# EAGLE board das48 (EAGLE 9.6.2), part 1 of 2
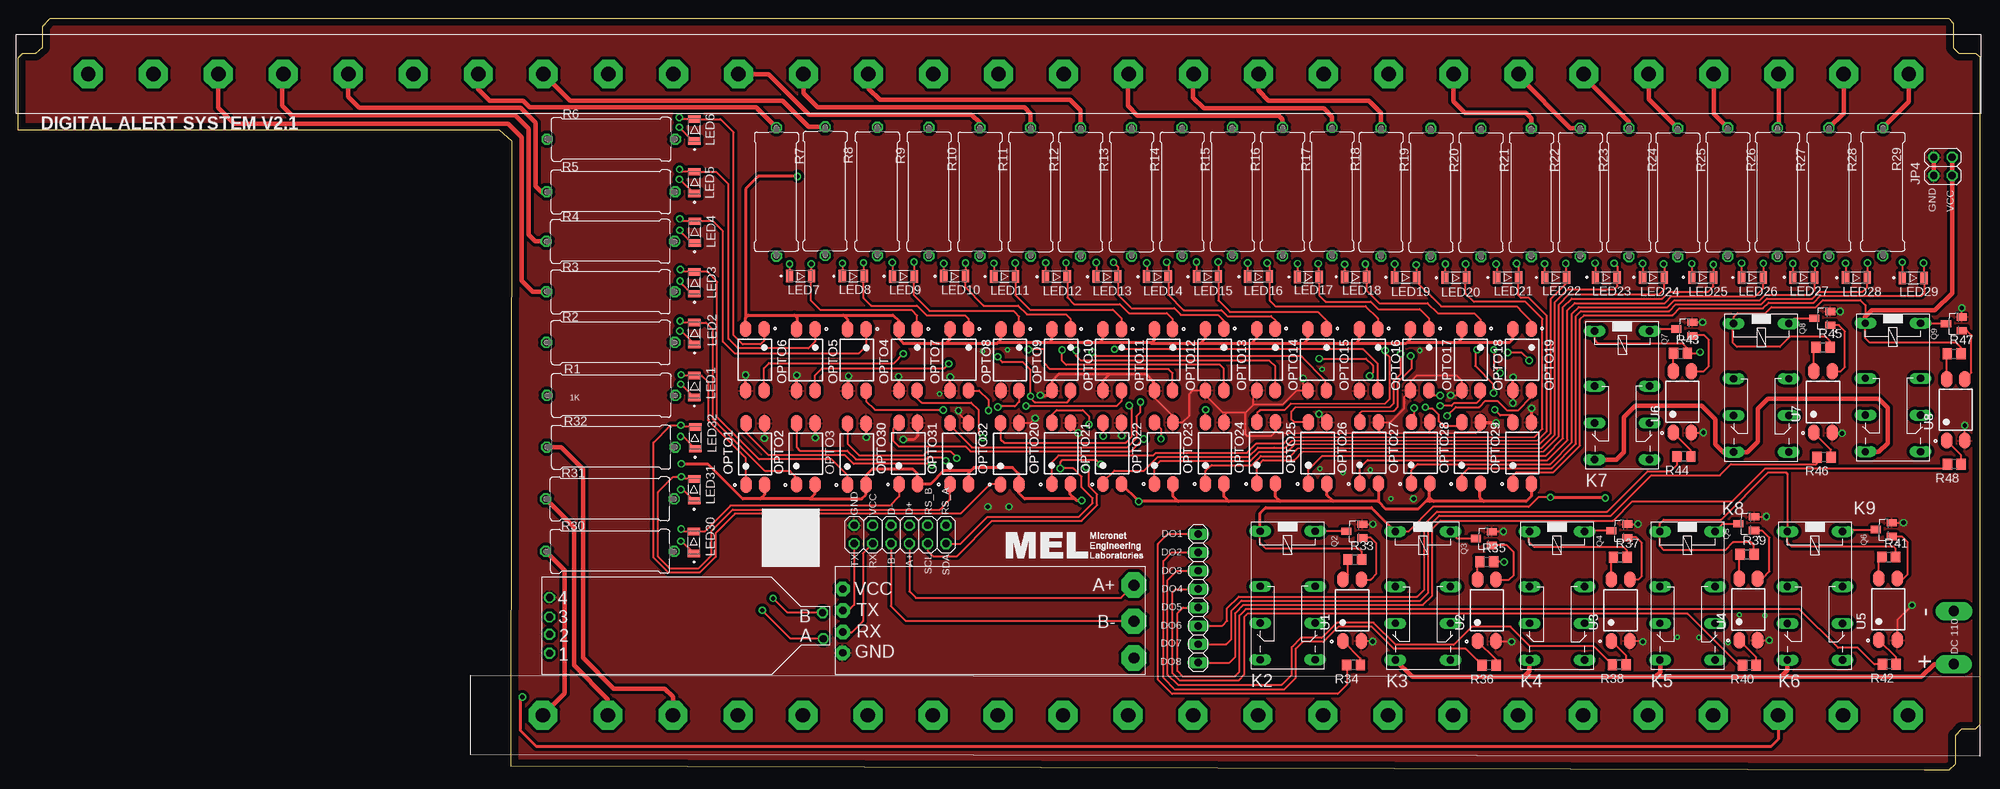
[diagram p2: board, top side]
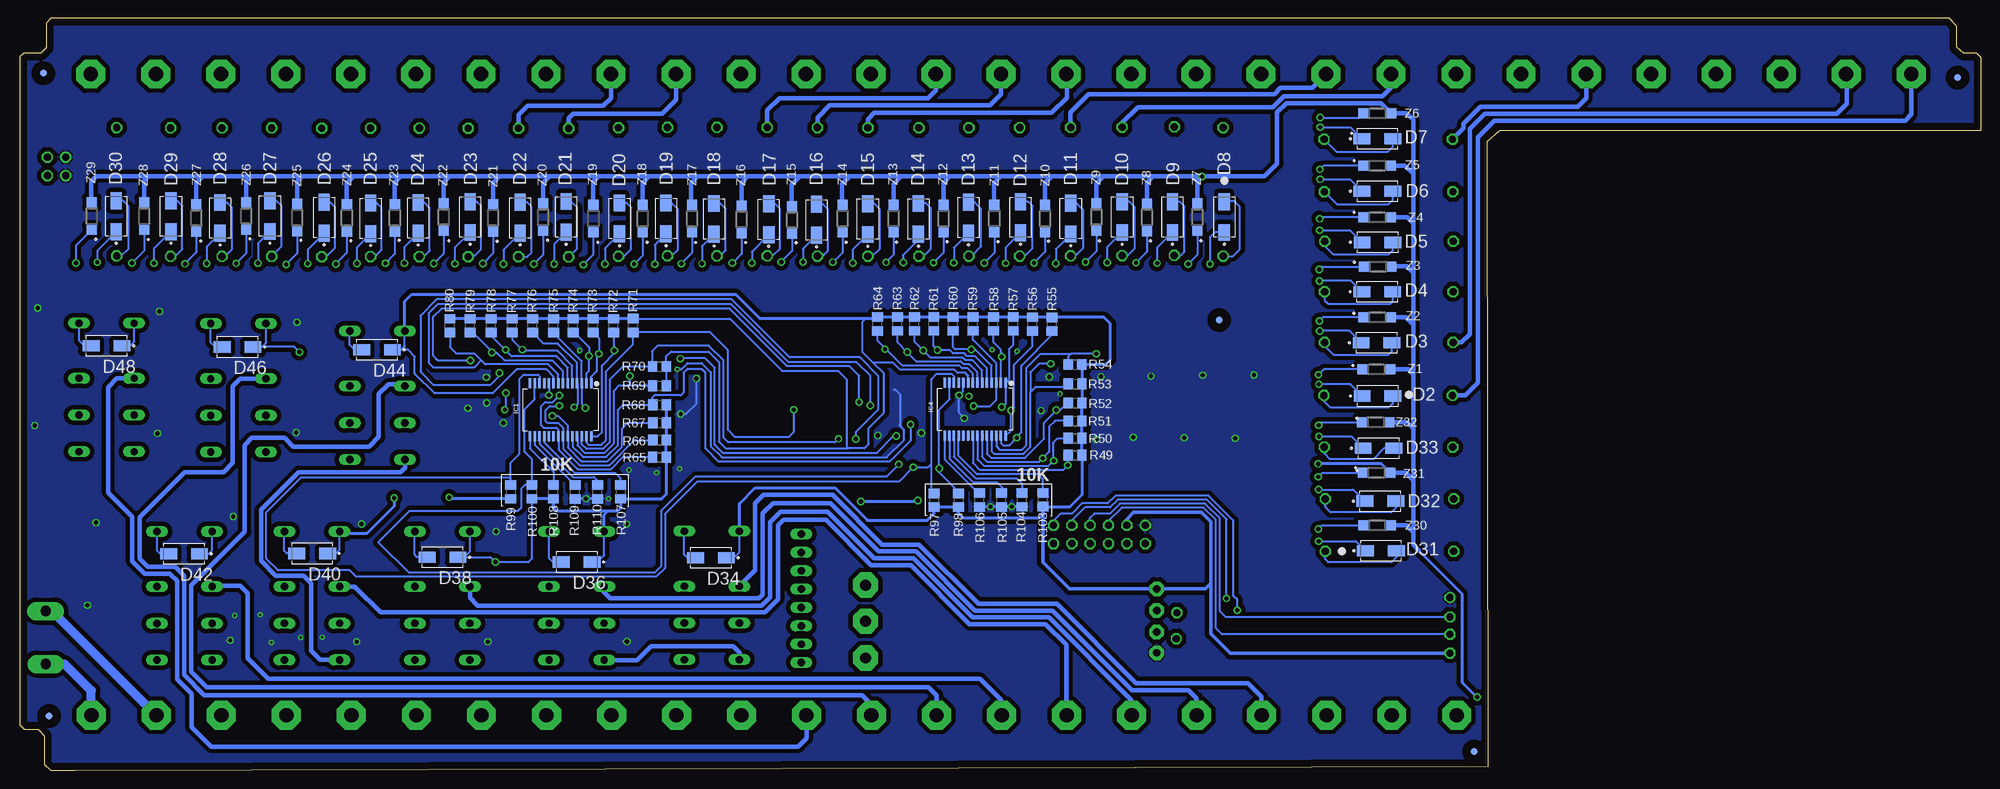
[diagram p3: board, bottom side, seen from below]

Size 271.53 x 104.12 mm. Coordinates in mm from the lower left corner, seen from the top.
Outline: 0.01,88.6 0,97.18 0.01,98.6 0.67,99.26 2.42,99.26 3.4,100.11 3.41,102.98 4.42,104.12 6.94,104.12 264.15,104.12 267.26,104.12 267.87,103.39 267.87,100.03 268.62,99.28 271.02,99.28 271.53,98.77 271.53,96.75 271.53,6.29 270.9,5.67 268.97,5.67 268.14,4.82 268.14,0.86 267.28,0 263.89,0 263.89,0 68.27,0.57 68.37,87.09 66.67,88.6 0.01,88.6
Copper layers (1*16): Top 0.035mm / dielectric 1.5mm / Bottom 0.035mm
Design rules "default *": minimum track width 6mil, minimum drill 0.3mm, track to track 6mil, track to pad 6mil, pad to pad 6mil, via to via 6mil, smd to smd 6mil, copper to edge 40mil, drill to drill 6mil, minimum pad ring 10mil, minimum via ring 8mil, stop-mask expansion 4mil, vias tented up to drill 0mil, thermal gap 10mil
Net classes: 0 default: drill 0.6 mm, clearance 0.3 mm

## Footprints (pad centres in the part's own frame; a part is rotated, then mirrored left to right if it is on the bottom)
DIOM5226X240N = smd 2.33 x 1.55: A 2.135,0; C -2.135,0
HEADER-29P = drill 2 pad 4 octagon: 1 -109,16.5; 2 -100,16.5; 3 -91,16.5; 4 -82,16.5; 5 -73,16.5; 6 -64,16.5; 7 -55,16.5; 8 -46,16.5; 9 -37,16.5; 10 -28,16.5; 11 -19,16.5; 12 -10,16.5; 13 -1,16.5; 14 8,16.5; 15 17,16.5; 16 26,16.5; 17 35,16.5; 18 44,16.5; 19 53,16.5; 20 62,16.5; 21 71,16.5; 22 80,16.5
HEADER-29P' = drill 2 pad 4 octagon: 1 -116.62,5.07; 2 -107.62,5.07; 3 -98.62,5.07; 4 -89.62,5.07; 5 -80.62,5.07; 6 -71.62,5.07; 7 -62.62,5.07; 8 -53.62,5.07; 9 -44.62,5.07; 10 -35.62,5.07; 11 -26.62,5.07; 12 -17.62,5.07; 13 -8.62,5.07; 14 0.38,5.07; 15 9.38,5.07; 16 18.38,5.07; 17 27.38,5.07; 18 36.38,5.07; 19 45.38,5.07; 20 54.38,5.07; 21 63.38,5.07; 22 72.38,5.07; 23 81.38,5.07; 24 90.38,5.07; 25 99.38,5.07; 26 108.38,5.07; 27 117.38,5.07; 28 126.38,5.07; 29 135.38,5.07
SSOP28DB = smd 0.348 x 1.397: 1 -4.225,-3.656; 2 -3.575,-3.656; 3 -2.925,-3.656; 4 -2.275,-3.656; 5 -1.625,-3.656; 6 -0.975,-3.656; 7 -0.325,-3.656; 8 0.325,-3.656; 9 0.975,-3.656; 10 1.625,-3.656; 11 2.275,-3.656; 12 2.925,-3.656; 13 3.575,-3.656; 14 4.225,-3.656; 15 4.225,3.656; 16 3.575,3.656; 17 2.925,3.656; 18 2.275,3.656; 19 1.625,3.656; 20 0.975,3.656; 21 0.325,3.656; 22 -0.325,3.656; 23 -0.975,3.656; 24 -1.625,3.656; 25 -2.275,3.656; 26 -2.925,3.656; 27 -3.575,3.656; 28 -4.225,3.656
1X1-BIGPOGO = drill 1.4 pad 2.54 long: P$1 0,0
2X06 = drill 1.016 octagon: 1 -6.35,-1.27; 2 -6.35,1.27; 3 -3.81,-1.27; 4 -3.81,1.27; 5 -1.27,-1.27; 6 -1.27,1.27; 7 1.27,-1.27; 8 1.27,1.27; 9 3.81,-1.27; 10 3.81,1.27; 11 6.35,-1.27; 12 6.35,1.27
2X02 = drill 1.016 octagon: 1 -1.27,-1.27; 2 -1.27,1.27; 3 1.27,-1.27; 4 1.27,1.27
1X08 = drill 1.016 long: 1 -8.89,0; 2 -6.35,0; 3 -3.81,0; 4 -1.27,0; 5 1.27,0; 6 3.81,0; 7 6.35,0; 8 8.89,0
351 = drill 1.016 long: 1 -3.81,-3.81; 16 -3.81,3.81; O1 8.89,-3.81; O2 8.89,3.81; P1 3.81,-3.81; P2 3.81,3.81; S1 13.97,-3.81; S2 13.97,3.81
LEDC3216X120N = smd 1.01 x 1.73: + -1.51,0; - 1.51,0
SOT254P975X400-4N = smd 2.25 x 1.6: 1 -4.25,1.27; 2 -4.25,-1.27; 3 4.25,-1.27; 4 4.25,1.27
SOT95P240X120-3N = smd 1 x 1.4: 1 -0.95,-1.1; 2 0.95,-1.1; 3 0,1.1
0617/17 = drill 1.016 octagon: 1 -8.89,0; 2 8.89,0
R0805 = smd 1.3 x 1.5: 1 -0.95,0; 2 0.95,0
TTL-RS485 = drill 1.5 pad 3.5 octagon: A -19.7,-6; B -19.7,-1; P$7 -19.7,4.1 | drill 1 pad 2 octagon: GND 20.6,3.37; RX 20.581,0.505; TX 20.583,-2.493; VCC 20.6,-5.47
FIDUCIAL_1MM = smd 1 x 1: 1 0,0
USB2RS485 = drill 1 pad 1.422 octagon: 1 36.9,3.6; 2 36.9,1; 3 36.9,-1.4; 4 36.9,-4.1; A -1,1.6; B -0.9,-2
SOD123 = smd 1.4 x 1.4: A 1.9,0; C -1.9,0

## Placement (x,y rotation side)
D2  US1M-13  [DIOM5226X240N]  83.59,51.83 0 bottom
D3  US1M-13  [DIOM5226X240N]  83.72,59.18 0 bottom
D4  US1M-13  [DIOM5226X240N]  83.64,66.26 0 bottom
D5  US1M-13  [DIOM5226X240N]  83.6,73.07 0 bottom
D6  US1M-13  [DIOM5226X240N]  83.62,80.16 0 bottom
D7  US1M-13  [DIOM5226X240N]  83.61,87.41 0 bottom
D8  US1M-13  [DIOM5226X240N]  104.81,76.59 90 bottom
D9  US1M-13  [DIOM5226X240N]  111.99,76.58 90 bottom
D10  US1M-13  [DIOM5226X240N]  118.94,76.59 90 bottom
D11  US1M-13  [DIOM5226X240N]  126.06,76.37 90 bottom
D12  US1M-13  [DIOM5226X240N]  133.02,76.55 90 bottom
D13  US1M-13  [DIOM5226X240N]  140.22,76.51 90 bottom
D14  US1M-13  [DIOM5226X240N]  147.16,76.32 90 bottom
D15  US1M-13  [DIOM5226X240N]  154.16,76.3 90 bottom
D16  US1M-13  [DIOM5226X240N]  161.23,76.2 90 bottom
D17  US1M-13  [DIOM5226X240N]  167.87,76.27 90 bottom
D18  US1M-13  [DIOM5226X240N]  175.46,76.34 90 bottom
D19  US1M-13  [DIOM5226X240N]  182.1,76.39 90 bottom
D20  US1M-13  [DIOM5226X240N]  188.54,76.39 90 bottom
D21  US1M-13  [DIOM5226X240N]  195.91,76.59 90 bottom
D22  US1M-13  [DIOM5226X240N]  202.3,76.48 90 bottom
D23  US1M-13  [DIOM5226X240N]  209.2,76.58 90 bottom
D24  US1M-13  [DIOM5226X240N]  216.41,76.47 90 bottom
D25  US1M-13  [DIOM5226X240N]  222.99,76.39 90 bottom
D26  US1M-13  [DIOM5226X240N]  229.41,76.5 90 bottom
D27  US1M-13  [DIOM5226X240N]  236.92,76.72 90 bottom
D28  US1M-13  [DIOM5226X240N]  243.82,76.46 90 bottom
D29  US1M-13  [DIOM5226X240N]  250.61,76.7 90 bottom
D30  US1M-13  [DIOM5226X240N]  258.19,76.7 90 bottom
D31  US1M-13  [DIOM5226X240N]  83.13,30.39 0 bottom
D32  US1M-13  [DIOM5226X240N]  83.21,37.28 0 bottom
D33  US1M-13  [DIOM5226X240N]  83.46,44.58 0 bottom
D34  US1M-13  [DIOM5226X240N]  175.88,29.42 180 bottom
D36  US1M-13  [DIOM5226X240N]  194.45,28.85 180 bottom
D38  US1M-13  [DIOM5226X240N]  213.02,29.52 180 bottom
D40  US1M-13  [DIOM5226X240N]  231.06,30.03 180 bottom
D42  US1M-13  [DIOM5226X240N]  248.8,29.98 180 bottom
D44  US1M-13  [DIOM5226X240N]  222.09,58.23 180 bottom
D46  US1M-13  [DIOM5226X240N]  241.4,58.61 180 bottom
D48  US1M-13  [DIOM5226X240N]  259.53,58.76 180 bottom
HEADER-22P1  [HEADER-29P]  181.64,-8.86 0 top
HEADER-29P1  [HEADER-29P']  126.33,91.31 0 top
IC1  MCP23017SS  [SSOP28DB]  196.68,49.91 180 bottom
IC4  MCP23017SS  [SSOP28DB]  139.3,49.98 180 bottom
JP1  [1X1-BIGPOGO]  267.95,14.73 180 top
JP2  [2X06]  122.1,32.66 0 top
JP3  [1X1-BIGPOGO]  267.97,22.07 180 top
JP4  [2X02]  266.44,83.6 90 top
JP5  [1X08]  163.35,23.82 270 top
K2  351  [351]  175.73,29.29 270 top
K3  351  [351]  194.46,29.25 270 top
K4  351  [351]  213.02,29.26 270 top
K5  351  [351]  231.07,29.26 270 top
K6  351  [351]  248.72,29.25 270 top
K7  351  [351]  222.05,56.99 270 top
K8  351  [351]  241.3,58.03 270 top
K9  351  [351]  259.52,58.08 270 top
LED1  LHN974_RED_LED_1206  [LEDC3216X120N]  93.61,53.14 90 top
LED2  LHN974_RED_LED_1206  [LEDC3216X120N]  93.62,60.48 90 top
LED3  LHN974_RED_LED_1206  [LEDC3216X120N]  93.63,67.48 90 top
LED4  LHN974_RED_LED_1206  [LEDC3216X120N]  93.67,74.5 90 top
LED5  LHN974_RED_LED_1206  [LEDC3216X120N]  93.62,81.33 90 top
LED6  LHN974_RED_LED_1206  [LEDC3216X120N]  93.64,88.63 90 top
LED7  LHN974_RED_LED_1206  [LEDC3216X120N]  108.31,68.42 0 top
LED8  LHN974_RED_LED_1206  [LEDC3216X120N]  115.61,68.41 0 top
LED9  LHN974_RED_LED_1206  [LEDC3216X120N]  122.56,68.39 0 top
LED10  LHN974_RED_LED_1206  [LEDC3216X120N]  129.65,68.4 0 top
LED11  LHN974_RED_LED_1206  [LEDC3216X120N]  136.56,68.36 0 top
LED12  LHN974_RED_LED_1206  [LEDC3216X120N]  143.74,68.33 0 top
LED13  LHN974_RED_LED_1206  [LEDC3216X120N]  150.73,68.34 0 top
LED14  LHN974_RED_LED_1206  [LEDC3216X120N]  157.7,68.34 0 top
LED15  LHN974_RED_LED_1206  [LEDC3216X120N]  164.64,68.34 0 top
LED16  LHN974_RED_LED_1206  [LEDC3216X120N]  171.72,68.34 0 top
LED17  LHN974_RED_LED_1206  [LEDC3216X120N]  178.59,68.29 0 top
LED18  LHN974_RED_LED_1206  [LEDC3216X120N]  185.15,68.3 0 top
LED19  LHN974_RED_LED_1206  [LEDC3216X120N]  192.07,68.25 0 top
LED20  LHN974_RED_LED_1206  [LEDC3216X120N]  199.02,68.19 0 top
LED21  LHN974_RED_LED_1206  [LEDC3216X120N]  206.18,68.23 0 top
LED22  LHN974_RED_LED_1206  [LEDC3216X120N]  212.85,68.23 0 top
LED23  LHN974_RED_LED_1206  [LEDC3216X120N]  219.83,68.24 0 top
LED24  LHN974_RED_LED_1206  [LEDC3216X120N]  226.37,68.25 0 top
LED25  LHN974_RED_LED_1206  [LEDC3216X120N]  233.19,68.24 0 top
LED26  LHN974_RED_LED_1206  [LEDC3216X120N]  240.08,68.22 0 top
LED27  LHN974_RED_LED_1206  [LEDC3216X120N]  247.18,68.24 0 top
LED28  LHN974_RED_LED_1206  [LEDC3216X120N]  254.45,68.21 0 top
LED29  LHN974_RED_LED_1206  [LEDC3216X120N]  262.33,68.18 0 top
LED30  LHN974_RED_LED_1206  [LEDC3216X120N]  93.56,31.55 90 top
LED31  LHN974_RED_LED_1206  [LEDC3216X120N]  93.6,38.83 90 top
LED32  LHN974_RED_LED_1206  [LEDC3216X120N]  93.73,46.03 90 top
OPTO1  PC817X2NIP0F  [SOT254P975X400-4N]  102.03,43.8 90 top
OPTO2  PC817X2NIP0F  [SOT254P975X400-4N]  109.03,43.81 90 top
OPTO3  PC817X2NIP0F  [SOT254P975X400-4N]  116.09,43.78 90 top
OPTO4  PC817X2NIP0F  [SOT254P975X400-4N]  116.11,56.81 270 top
OPTO5  PC817X2NIP0F  [SOT254P975X400-4N]  109.06,56.81 270 top
OPTO6  PC817X2NIP0F  [SOT254P975X400-4N]  101.99,56.83 270 top
OPTO7  PC817X2NIP0F  [SOT254P975X400-4N]  123.18,56.82 270 top
OPTO8  PC817X2NIP0F  [SOT254P975X400-4N]  130.27,56.82 270 top
OPTO9  PC817X2NIP0F  [SOT254P975X400-4N]  137.31,56.82 270 top
OPTO10  PC817X2NIP0F  [SOT254P975X400-4N]  144.39,56.82 270 top
OPTO11  PC817X2NIP0F  [SOT254P975X400-4N]  151.47,56.82 270 top
OPTO12  PC817X2NIP0F  [SOT254P975X400-4N]  158.55,56.82 270 top
OPTO13  PC817X2NIP0F  [SOT254P975X400-4N]  165.63,56.83 270 top
OPTO14  PC817X2NIP0F  [SOT254P975X400-4N]  172.74,56.83 270 top
OPTO15  PC817X2NIP0F  [SOT254P975X400-4N]  179.83,56.83 270 top
OPTO16  PC817X2NIP0F  [SOT254P975X400-4N]  186.95,56.83 270 top
OPTO17  PC817X2NIP0F  [SOT254P975X400-4N]  194.03,56.84 270 top
OPTO18  PC817X2NIP0F  [SOT254P975X400-4N]  201.11,56.85 270 top
OPTO19  PC817X2NIP0F  [SOT254P975X400-4N]  208.19,56.85 270 top
OPTO20  PC817X2NIP0F  [SOT254P975X400-4N]  144.39,43.88 90 top
OPTO21  PC817X2NIP0F  [SOT254P975X400-4N]  151.47,43.88 90 top
OPTO22  PC817X2NIP0F  [SOT254P975X400-4N]  158.6,43.91 90 top
OPTO23  PC817X2NIP0F  [SOT254P975X400-4N]  165.66,43.92 90 top
OPTO24  PC817X2NIP0F  [SOT254P975X400-4N]  172.78,43.96 90 top
OPTO25  PC817X2NIP0F  [SOT254P975X400-4N]  179.91,43.93 90 top
OPTO26  PC817X2NIP0F  [SOT254P975X400-4N]  187.01,43.96 90 top
OPTO27  PC817X2NIP0F  [SOT254P975X400-4N]  194.14,43.96 90 top
OPTO28  PC817X2NIP0F  [SOT254P975X400-4N]  201.14,43.95 90 top
OPTO29  PC817X2NIP0F  [SOT254P975X400-4N]  208.22,43.92 90 top
OPTO30  PC817X2NIP0F  [SOT254P975X400-4N]  123.22,43.86 90 top
OPTO31  PC817X2NIP0F  [SOT254P975X400-4N]  130.28,43.85 90 top
OPTO32  PC817X2NIP0F  [SOT254P975X400-4N]  137.29,43.84 90 top
Q2  S9013  [SOT95P240X120-3N]  184.96,33.12 90 top
Q3  S9013  [SOT95P240X120-3N]  202.89,32.09 90 top
Q4  S9013  [SOT95P240X120-3N]  221.65,33.16 90 top
Q5  S9013  [SOT95P240X120-3N]  239.2,34.16 90 top
Q6  S9013  [SOT95P240X120-3N]  258.26,33.34 90 top
Q7  S9013  [SOT95P240X120-3N]  230.66,61.09 90 top
Q8  S9013  [SOT95P240X120-3N]  249.76,62.57 90 top
Q9  S9013  [SOT95P240X120-3N]  267.97,61.82 90 top
R1  [0617/17]  82.12,51.91 0 top
R2  [0617/17]  82.03,59.23 0 top
R3  [0617/17]  82.02,66.25 0 top
R4  [0617/17]  82,73.23 0 top
R5  [0617/17]  82.06,80.09 0 top
R6  [0617/17]  82.11,87.35 0 top
R7  [0617/17]  104.97,80.08 270 top
R8  [0617/17]  111.72,80.18 270 top
R9  [0617/17]  118.94,80.13 270 top
R10  [0617/17]  126.07,80.11 270 top
R11  [0617/17]  133.13,80.08 270 top
R12  [0617/17]  140.18,80.06 270 top
R13  [0617/17]  147.08,80.05 270 top
R14  [0617/17]  154.14,80.06 270 top
R15  [0617/17]  161.12,80.08 270 top
R16  [0617/17]  168.08,80.1 270 top
R17  [0617/17]  175.05,80.09 270 top
R18  [0617/17]  181.89,80.11 270 top
R19  [0617/17]  188.66,80.05 270 top
R20  [0617/17]  195.56,79.97 270 top
R21  [0617/17]  202.51,79.98 270 top
R22  [0617/17]  209.47,79.98 270 top
R23  [0617/17]  216.23,80 270 top
R24  [0617/17]  222.98,80.01 270 top
R25  [0617/17]  229.74,79.98 270 top
R26  [0617/17]  236.67,80.04 270 top
R27  [0617/17]  243.55,80.03 270 top
R28  [0617/17]  250.66,80.03 270 top
R29  [0617/17]  258.13,80.09 270 top
R30  [0617/17]  81.95,30.33 0 top
R31  [0617/17]  81.93,37.58 0 top
R32  [0617/17]  82.08,44.76 0 top
R33  10k  [R0805]  185.03,29.2 0 top
R34  330  [R0805]  184.87,14.59 180 top
R35  10k  [R0805]  203.3,28.9 0 top
R36  330  [R0805]  203.63,14.55 180 top
R37  10k  [R0805]  221.77,29.53 0 top
R38  330  [R0805]  221.64,14.63 180 top
R39  10k  [R0805]  239.34,29.92 0 top
R40  330  [R0805]  239.63,14.56 180 top
R41  10k  [R0805]  258.95,29.55 0 top
R42  330  [R0805]  259.02,14.68 180 top
R43  10k  [R0805]  230.11,57.71 0 top
R44  330  [R0805]  230.6,43.45 180 top
R45  10k  [R0805]  249.84,58.55 0 top
R46  330  [R0805]  249.98,43.36 180 top
R47  10k  [R0805]  268,57.69 0 top
R48  330  [R0805]  268.02,42.36 180 top
R49  [R0805]  125.45,43.62 0 bottom
R50  [R0805]  125.46,45.96 0 bottom
R51  [R0805]  125.46,48.37 0 bottom
R52  [R0805]  125.46,50.84 0 bottom
R53  [R0805]  125.46,53.49 0 bottom
R54  [R0805]  125.47,56.19 0 bottom
R55  [R0805]  128.64,61.75 90 bottom
R56  [R0805]  131.37,61.77 90 bottom
R57  [R0805]  134.01,61.8 90 bottom
R58  [R0805]  136.76,61.8 90 bottom
R59  [R0805]  139.61,61.8 90 bottom
R60  [R0805]  142.35,61.8 90 bottom
R61  [R0805]  145.02,61.79 90 bottom
R62  [R0805]  147.71,61.8 90 bottom
R63  [R0805]  150.05,61.8 90 bottom
R64  [R0805]  152.79,61.78 90 bottom
R65  [R0805]  183,43.34 0 bottom
R66  [R0805]  182.98,45.72 0 bottom
R67  [R0805]  182.98,48.13 0 bottom
R68  [R0805]  182.97,50.6 0 bottom
R69  [R0805]  183,53.24 0 bottom
R70  [R0805]  183,55.9 0 bottom
R71  [R0805]  186.65,61.57 90 bottom
R72  [R0805]  189.33,61.57 90 bottom
R73  [R0805]  192.2,61.57 90 bottom
R74  [R0805]  194.93,61.57 90 bottom
R75  [R0805]  197.64,61.56 90 bottom
R76  [R0805]  200.56,61.56 90 bottom
R77  [R0805]  203.38,61.55 90 bottom
R78  [R0805]  206.3,61.56 90 bottom
R79  [R0805]  209.21,61.56 90 bottom
R80  [R0805]  211.99,61.56 90 bottom
R97  [R0805]  144.97,37.4 270 bottom
R98  [R0805]  141.59,37.4 270 bottom
R99  [R0805]  203.58,38.56 270 bottom
R100  [R0805]  200.65,38.55 270 bottom
R103  [R0805]  129.91,37.46 90 bottom
R104  [R0805]  132.81,37.45 90 bottom
R105  [R0805]  135.66,37.44 90 bottom
R106  [R0805]  138.7,37.43 90 bottom
R107  [R0805]  188.37,38.55 270 bottom
R108  [R0805]  197.67,38.56 90 bottom
R109  [R0805]  194.65,38.53 90 bottom
R110  [R0805]  191.55,38.54 90 bottom
TTL-RS1  [TTL-RS485]  134.75,19.65 180 top
U1  PC817X2NIP0F  [SOT254P975X400-4N]  184.66,22.17 90 top
U2  PC817X2NIP0F  [SOT254P975X400-4N]  203.31,22.16 90 top
U3  PC817X2NIP0F  [SOT254P975X400-4N]  221.82,22.18 90 top
U4  PC817X2NIP0F  [SOT254P975X400-4N]  239.52,22.28 90 top
U5  PC817X2NIP0F  [SOT254P975X400-4N]  258.86,22.3 90 top
U6  PC817X2NIP0F  [SOT254P975X400-4N]  230.37,51.01 90 top
U7  PC817X2NIP0F  [SOT254P975X400-4N]  249.86,51 90 top
U8  PC817X2NIP0F  [SOT254P975X400-4N]  268.21,49.9 90 top
U$1  FIDUCIAL  [FIDUCIAL_1MM]  3.3,95.88 0 bottom
U$2  FIDUCIAL  [FIDUCIAL_1MM]  268.28,96.49 0 bottom
U$3  FIDUCIAL  [FIDUCIAL_1MM]  105.51,62.33 0 bottom
U$4  FIDUCIAL  [FIDUCIAL_1MM]  267.46,7.54 0 bottom
U$5  FIDUCIAL  [FIDUCIAL_1MM]  70.21,2.61 0 bottom
USB2RS1  [USB2RS485]  110.46,19.84 180 top
Z1  [SOD123]  83.75,55.5 0 bottom
Z2  [SOD123]  83.62,62.71 0 bottom
Z3  [SOD123]  83.56,69.72 0 bottom
Z4  [SOD123]  83.62,76.54 0 bottom
Z5  [SOD123]  83.63,83.69 0 bottom
Z6  [SOD123]  83.61,90.94 0 bottom
Z7  [SOD123]  108.54,76.58 90 bottom
Z8  [SOD123]  115.51,76.55 90 bottom
Z9  [SOD123]  122.52,76.6 90 bottom
Z10  [SOD123]  129.6,76.37 90 bottom
Z11  [SOD123]  136.65,76.38 90 bottom
Z12  [SOD123]  143.66,76.38 90 bottom
Z13  [SOD123]  150.62,76.38 90 bottom
Z14  [SOD123]  157.67,76.37 90 bottom
Z15  [SOD123]  164.62,76.18 90 bottom
Z16  [SOD123]  171.62,76.26 90 bottom
Z17  [SOD123]  178.5,76.36 90 bottom
Z18  [SOD123]  185.32,76.36 90 bottom
Z19  [SOD123]  192.15,76.39 90 bottom
Z20  [SOD123]  199.07,76.57 90 bottom
Z21  [SOD123]  206.02,76.47 90 bottom
Z22  [SOD123]  212.87,76.59 90 bottom
Z23  [SOD123]  219.61,76.48 90 bottom
Z24  [SOD123]  226.26,76.46 90 bottom
Z25  [SOD123]  233.13,76.51 90 bottom
Z26  [SOD123]  240.18,76.74 90 bottom
Z27  [SOD123]  247.11,76.46 90 bottom
Z28  [SOD123]  254.32,76.71 90 bottom
Z29  [SOD123]  261.58,76.71 90 bottom
Z30  [SOD123]  83.65,33.92 0 bottom
Z31  [SOD123]  83.74,41.19 0 bottom
Z32  [SOD123]  83.84,48.21 0 bottom